# EAGLE design Zeitraffer_V0.2 (EAGLE 8.3.2)
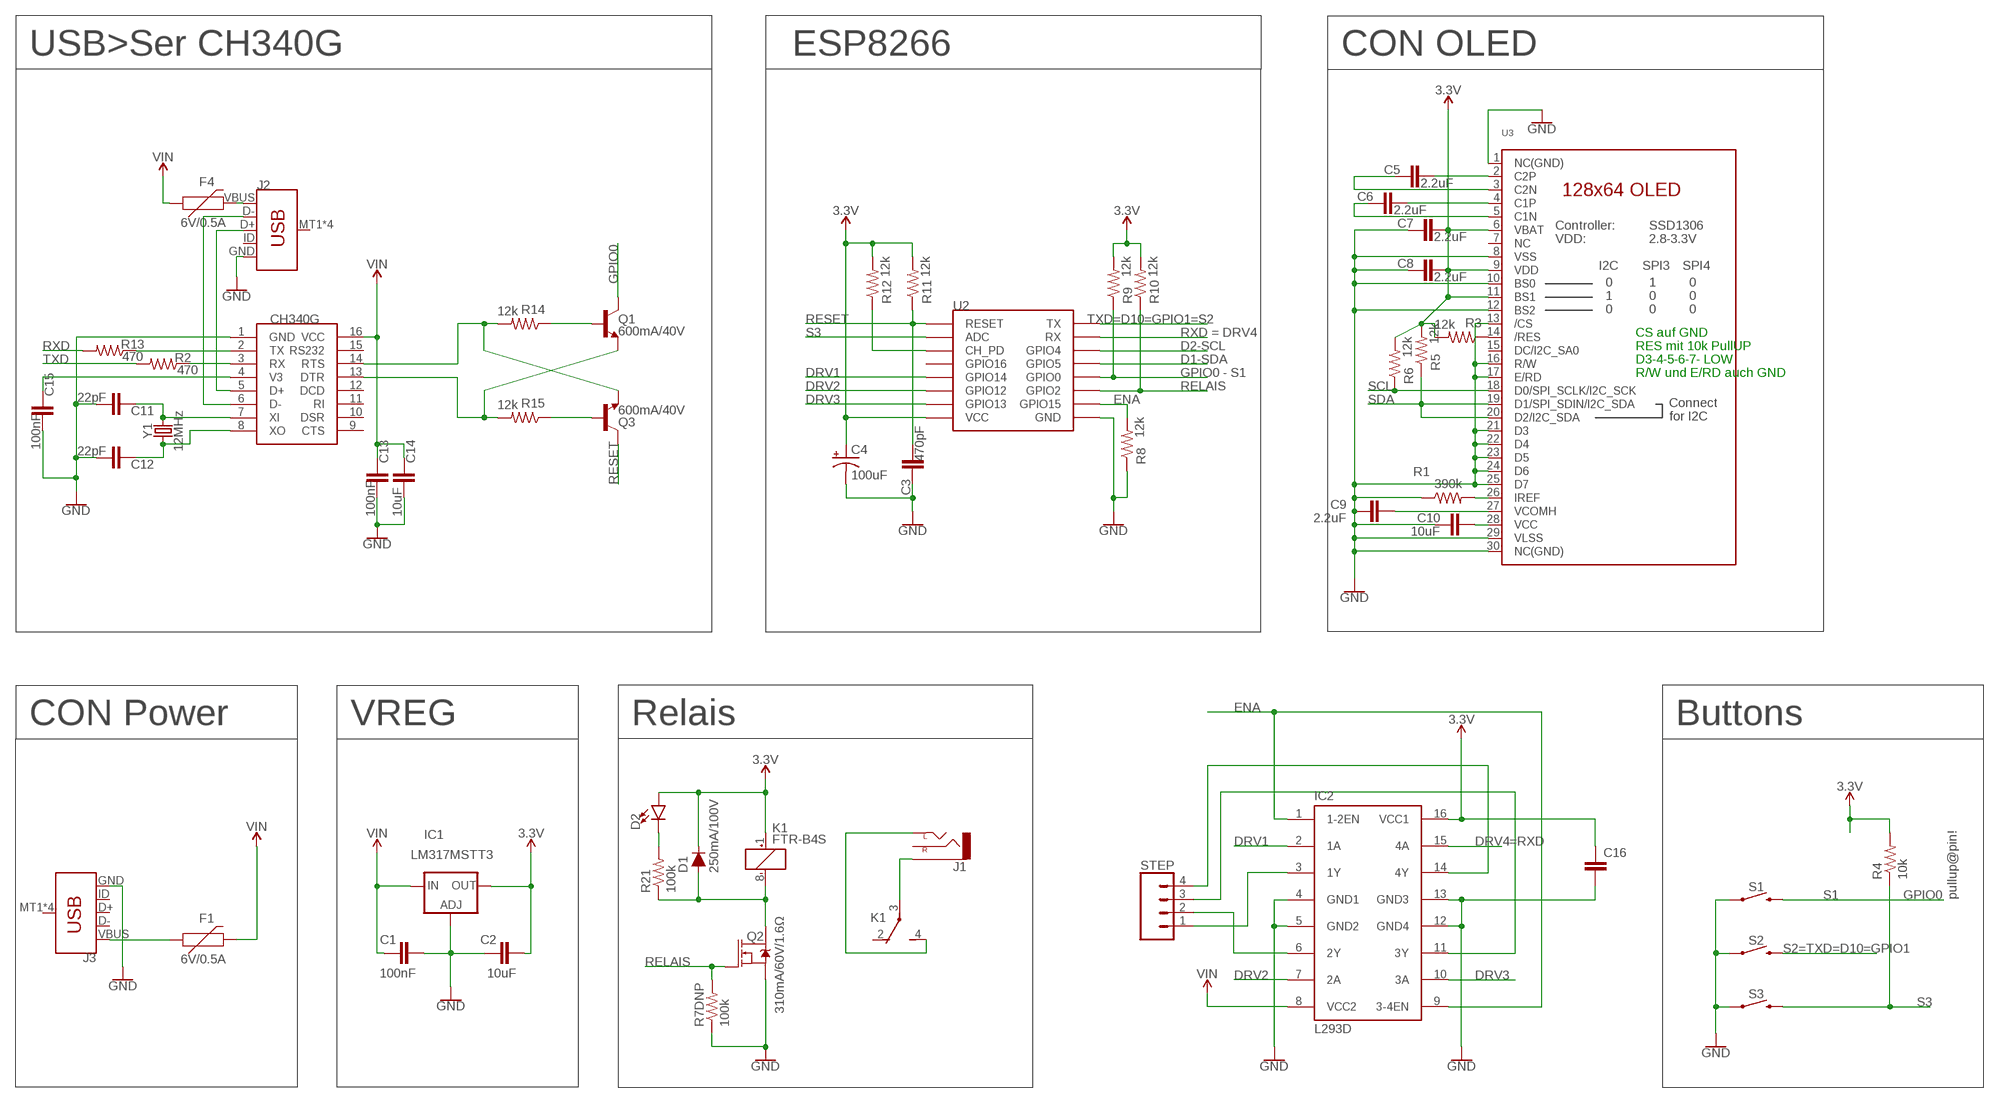
[diagram p0: schematic, sheet 1]

## Parts
C1  100nF  1.0UF-0805-25V-10%  [0805]
C2  10uF  0.33UF/330NF-0805-50V-10%  [0805]
C3  470pF  2.2UF-0805-25V-(+80/-20%)  [0805]
C4  100uF  100UF-POLAR-EIA7343-16V-10%(TANT)  [EIA7343]
C5  2.2uF  2.2UF-0805-25V-(+80/-20%)  [0805]
C6  2.2uF  2.2UF-0805-25V-(+80/-20%)  [0805]
C7  2.2uF  2.2UF-0805-25V-(+80/-20%)  [0805]
C8  2.2uF  2.2UF-0805-25V-(+80/-20%)  [0805]
C9  2.2uF  2.2UF-0805-25V-(+80/-20%)  [0805]
C10  10uF  2.2UF-0805-25V-(+80/-20%)  [0805]
C11  22pF  2.2UF-0805-25V-(+80/-20%)  [0805]
C12  22pF  2.2UF-0805-25V-(+80/-20%)  [0805]
C13  100nF  2.2UF-0805-25V-(+80/-20%)  [0805]
C14  10uF  2.2UF-0805-25V-(+80/-20%)  [0805]
C15  100nF  2.2UF-0805-25V-(+80/-20%)  [0805]
C16  C-EUC0805  [C0805]
D1  250mA/100V  DIODE-BAS16J  [SOD-323]
D2  LED1206-BOTTOM  [LED-1206-BOTTOM]
F1  6V/0.5A  PPTC_HALF-AMP  [1206]
F4  6V/0.5A  PPTC_HALF-AMP  [1206]
IC1  LM317MSTT3  [SOT223]
IC2  L293D  [DIL16]
J1  AUDIO_JACK_2.5MM_2.5MM  [STEREOJACK2.5MM_STEREOJACK2.5MM]
J2  USB_MICRO-B_SMT  [USB-MICROB]
J3  USB_MICRO-B_SMT  [USB-MICROB]
K1  FTR-B4S  [FTR-B4S]
Q1  600mA/40V  TRANS_NPN-MMBT2222AL  [SOT23-3]
Q2  310mA/60V/1.6Ω  MOSFET-NCH-2N7002PW  [SOT323]
Q3  600mA/40V  TRANS_NPN-MMBT2222AL  [SOT23-3]
R1  390k  0.75OHM-0805-1/4W-1%  [0805]
R2  470  470OHM-0603-1/10W-1%  [0603]
R3  12k  R-US_R0805  [R0805]
R4  10k  R-US_R0805  [R0805]
R5  12k  R-US_R0805  [R0805]
R6  12k  R-US_R0805  [R0805]
R7DNP  100k  R-US_R0805  [R0805]
R8  12k  R-US_R0805  [R0805]
R9  12k  R-US_R0805  [R0805]
R10  12k  R-US_R0805  [R0805]
R11  12k  R-US_R0805  [R0805]
R12  12k  R-US_R0805  [R0805]
R13  470  470OHM-0603-1/10W-1%  [0603]
R14  12k  R-US_R0805  [R0805]
R15  12k  R-US_R0805  [R0805]
R21  100k  R-US_R0805  [R0805]
S1  MOMENTARY-SWITCH-SPST-PTH-6.0MM  [TACTILE_SWITCH_PTH_6.0MM]
S2  MOMENTARY-SWITCH-SPST-PTH-6.0MM  [TACTILE_SWITCH_PTH_6.0MM]
S3  MOMENTARY-SWITCH-SPST-PTH-6.0MM  [TACTILE_SWITCH_PTH_6.0MM]
STEP  CONN_04JST-PTH  [JST-4-PTH]
U2  ESP12SMD  [ESP12-SMD]
U3  DISP_OLED_UG-2864HSWEG01  [UG-2864HSWEG01_1.3_WRAPAROUND]
U$2  CH340G  [SOIC16]
Y1  12MHz  CRYSTAL-12MHZ"  [CRYSTAL-SMD-5X3.2-4PAD]

## Nets
3.3V: C2.2 C4.A(+) C7.2 C8.2 C16.1 D1.C D2.A IC1.4(OUT) IC2.16(VCC1) K1.1(K:+) R3.2 R4.2 R5.2 R6.2 R9.2 R10.2 R11.2 R12.2 U2.VCC U3.6(VBAT) U3.9(VDD) U3.11(BS1)
DRV1: IC2.2(1A) U2.GPIO14
DRV2: IC2.7(2A) U2.GPIO12
DRV3: IC2.10(3A) U2.GPIO13
ENA: IC2.1(1-2EN) IC2.9(3-4EN) R8.2 U2.GPIO15
GND: C1.2 C2.1 C3.1 C4.C(-) C7.1 C8.1 C9.1 C10.1 C11.2 C12.2 C13.2 C14.2 C15.2 C16.2 IC1.1(ADJ) IC2.4(GND1) IC2.5(GND2) IC2.12(GND4) IC2.13(GND3) J2.GND J3.GND Q2.2(S) R1.1 R7DNP.1 R8.1 S1.1 S2.1 S3.1 U2.GND U3.1(NC(GND)) U3.8(VSS) U3.10(BS0) U3.12(BS2) U3.13(/CS) U3.16(R/W) U3.17(E/RD) U3.21(D3) U3.22(D4) U3.23(D5) U3.24(D6) U3.25(D7) U3.29(VLSS) U3.30(NC(GND)) U$2.1(GND)
GPIO0: Q1.3(C) R9.1 S1.3 U2.GPIO0
N$1: F1.1 J3.VBUS
N$2: J1.RING1(SLEEVE) K1.3(-1:P)
N$3: D1.A K1.8(K:-) Q2.3(D) R21.1
N$4: J1.SHIELD(LEFT) K1.4(-1:S)
N$5: C5.2 U3.2(C2P)
N$6: C6.2 U3.4(C1P)
N$7: C5.1 U3.3(C2N)
N$8: C6.1 U3.5(C1N)
N$9: R1.2 U3.26(IREF)
N$10: C9.2 U3.27(VCOMH)
N$11: C10.2 U3.28(VCC)
N$12: R3.1 U3.14(/RES)
N$14: C11.1 U$2.7(XI) Y1.3
N$15: R12.1 U2.CH_PD
N$16: C12.1 U$2.8(XO) Y1.1
N$18: J2.D+ U$2.5(D+)
N$20: J2.D- U$2.6(D-)
N$21: Q3.2(E) R14.2 U$2.14(RTS)
N$22: Q1.2(E) R15.2 U$2.13(DTR)
N$23: R13.1 U$2.2(TX)
N$24: R2.1 U$2.3(RX)
N$25: C15.1 U$2.4(V3)
N$26: Q3.1(B) R15.1
N$27: Q1.1(B) R14.1
N$28: IC2.3(1Y) STEP.1
N$29: IC2.6(2Y) STEP.2
N$30: F4.2 J2.VBUS
N$31: D2.C R21.2
N$32: IC2.14(4Y) STEP.4
N$33: IC2.11(3Y) STEP.3
RELAIS: Q2.1(G) R7DNP.2 R10.1 U2.GPIO2
RESET: C3.2 Q3.3(C) R11.1 U2.RESET
RXD: IC2.15(4A) R13.2 U2.RXD0(RX)
S3: R4.1 S3.3 U2.ADC
SCL: R6.1 U2.GPIO4 U3.18(D0/SPI_SCLK/I2C_SCK)
SDA: R5.1 U2.GPIO5 U3.19(D1/SPI_SDIN/I2C_SDA) U3.20(D2/I2C_SDA)
TXD: R2.2 S2.3 U2.TXD0(TX)
VIN: C1.1 C13.1 C14.1 F1.2 F4.1 IC1.3(IN) IC2.8(VCC2) U$2.16(VCC)
Unconnected: J1.TIP(RIGHT) J2.ID J2.MT1(SHIELD) J2.MT2(SHIELD) J2.P$1(SHIELD) J2.P$2(SHIELD) J3.D+ J3.D- J3.ID J3.MT1(SHIELD) J3.MT2(SHIELD) J3.P$1(SHIELD) J3.P$2(SHIELD) K1.2(-1:O) K1.5(-2:S) K1.6(-2:P) K1.7(-2:O) U2.GPIO16 U3.7(NC) U3.15(DC/I2C_SA0) U$2.9(CTS) U$2.10(DSR) U$2.11(RI) U$2.12(DCD) U$2.15(RS232)

## Notes on the sheet
- USB>Ser CH340G | ESP8266 | CON OLED
- GPIO0
- RESET | TXD=D10=GPIO1=S2
- S3 | RXD = DRV4 | CS auf GND
- RXD | D2-SCL | RES mit 10k PullUP
- TXD | D1-SDA | D3-4-5-6-7- LOW
- DRV1 | GPIO0 - S1 | R/W und E/RD auch GND
- DRV2 | RELAIS | SCL
- DRV3 | ENA | SDA
- RESET
- ENA
- CON Power | VREG | Relais | Buttons
- DRV1 | DRV4=RXD
- S1 | GPIO0 | pullup@pin!
- S2=TXD=D10=GPIO1
- RELAIS
- DRV2 | DRV3
- S3

## Library data of the parts
C1 = SparkFun-Capacitors:1.0UF: 1µF ceramic capacitors A capacitor is a passive two-terminal electrical component used to store electrical energy temporarily in an electric field.; PROD_ID: CAP-08064; VALUE: 1.0uF
C2 = SparkFun-Capacitors:0.33UF/330NF: 0.33µF/330nF ceramic capacitors A capacitor is a passive two-terminal electrical component used to store electrical energy temporarily in an electric field.; PROD_ID: CAP-08469; VALUE: 0.33µF
C3 C10-C15 = SparkFun-Capacitors:2.2UF: 2.2µF ceramic capacitors A capacitor is a passive two-terminal electrical component used to store electrical energy temporarily in an electric field.; PROD_ID: CAP-11624; VALUE: 2.2uF
C4 = SparkFun-Capacitors:100UF-POLAR: 100µF polarized capacitors A capacitor is a passive two-terminal electrical component used to store electrical energy temporarily in an electric field.; PROD_ID: CAP-08702
C5-C9 = SparkFun-Capacitors:2.2UF: 2.2µF ceramic capacitors A capacitor is a passive two-terminal electrical component used to store electrical energy temporarily in an electric field.; PROD_ID: CAP-11624
C16 = resistor:C-EU: CAPACITOR, European symbol
D1 = SparkFun-DiscreteSemi:DIODE: Diode These are standard reverse protection diodes and small signal diodes. SparkFun Products: SparkFun SparkPunk Sound Kit <https://www.sparkfun.com/products/11177> SparkFun ESP8266 Thing <https://www.sparkfun.com/products/13231>; PROD_ID: DIO-09646
D2 = SparkFun-LED:LED: LED (Generic) Standard schematic elements and footprints for 5mm, 3mm, 1206, and 0603 sized LEDs. Generic LEDs with no color specified.
F1 F4 = SparkFun-Fuses:PPTC: Resettable Fuse PPTC Resettable Fuse. Really a sort of resistor with a polymeric positive temperature coefficient whose resistance increases dramatically with an increase in temperature. When heated by the power passing through the resistance rises causing the current to be limited, protecting the circuit. This is achieved by the transition of the polymer from a crystalline to an amorphous state where the conductive carbon separates breaking the conductive pathways found in the cool crystalline structure. When a PPTC cools back down it resumes conducting letting the circuit turn back on. SparkFun Products: SparkFun RedBoard - Programmed with Arduino <https://www.sparkfun.com/products/12757> Pro Micro - 5V/16MHz <https://www.sparkfun.com/products/12640> Arduino Pro 328 - 5V/16MHz <https://www.sparkfun.com/products/10915> MP3 Trigger <https://www.sparkfun.com/products/13720>; PROD_ID: RES-08585
IC1 = v-reg:LM317?*: 500 mA Adjustable Output Positive Voltage Regulator Source: http://www.onsemi.co.jp .. LM317M-D.PDF
IC2 = L293D.lbrst-microelectronics:L293D: PUSH-PULL 4 CHANNEL DRIVER
J1 = SparkFun-Connectors:AUDIO_JACK_2.5MM: Audio Jack 2.5mm variants of PTH and SMT audio jacks. SparkFun Products: SparkFun PicoBoard <https://www.sparkfun.com/products/11888>- 2.5mm SMD; PROD_ID: CONN-09878
J2 J3 = SparkFun-Connectors:USB_MICRO-B: USB Type Micro-B Connector Male/female and PTH/SMT variants SparkFun Products: SparkFun microB USB Breakout <https://www.sparkfun.com/products/12035> SparkFun USB microB Plug Breakout <https://www.sparkfun.com/products/10031> SparkFun ESP8266 Thing <https://www.sparkfun.com/products/13231>; PROD_ID: CONN-09505; SF_ID: PRT-08533
K1 = relay:FTR-B4: ULTRA MINIATURE RELAY 2 POLES - 2 A (Slim Profile Signal Relay) FUJITSU FTR-B4 SERIES Source: FTR-B4.pdf
Q1 Q3 = SparkFun-DiscreteSemi:TRANS_NPN: NPN transistor Current controlled devices typically used to amplify current or used as a switch. BC547 - COM-08928 <http://www.sparkfun.com/products/8928> (TO-92 45V 100mA) (1.Collector 2.Base 3.Emitter) 2N3904 - COM-00521 <http://www.sparkfun.com/products/521> (TO-92 40V 200mA) (1.Emitter 2.Base 3.Collector) P2N2222A - COM-12852 <http://www.sparkfun.com/products/12852> (TO-92 40V 600mA) (1.Collector 2.Base 3.Emitter); PROD_ID: TRANS-08049
Q2 = SparkFun-DiscreteSemi:MOSFET-NCH: N-channel MOSFETs Voltage controlled devices that allow control of high current outputs. SparkFun Products: SparkFun OpenScale <https://www.sparkfun.com/products/13261> SparkFun Digital Sandbox <https://www.sparkfun.com/products/12651> SparkFun Monster Moto Shield <https://www.sparkfun.com/products/10182> SparkFun MOSFET Power Controller <https://www.sparkfun.com/products/11214>; PROD_ID: TRANS-11151
R1 = SparkFun-Resistors:0.75OHM: 0.75Ω resistor A resistor is a passive two-terminal electrical component that implements electrical resistance as a circuit element. Resistors act to reduce current flow, and, at the same time, act to lower voltage levels within circuits. - Wikipedia; PROD_ID: RES-08474; VALUE: 0.75
R2 R13 = SparkFun-Resistors:470OHM: 470Ω resistor A resistor is a passive two-terminal electrical component that implements electrical resistance as a circuit element. Resistors act to reduce current flow, and, at the same time, act to lower voltage levels within circuits. - Wikipedia; PROD_ID: RES-07869
R3-R6 R7DNP R8-R12 R14 R15 R21 = adafruit:R-US_: RESISTOR, American symbol
S1-S3 = SparkFun-Switches:MOMENTARY-SWITCH-SPST: Momentary Switch (Pushbutton) - SPST Normally-open (NO) SPST momentary switches (buttons, pushbuttons). Variants PTH-12MM - 12mm square, through-hole Momentary Pushbutton Switch - 12mm Square <https://www.sparkfun.com/products/9190> (COM-09190) PTH-6.0MM, PTH-6.0MM-KIT - 6.0mm square, through-hole Mini Pushbutton Switch <https://www.sparkfun.com/products/97> (COM-00097) KIT package intended for soldering kit's - only one side of pads' copper is exposed. PTH-RIGHT-ANGLE-KIT - Right-angle, through-hole Right Angle Tactile Button <https://www.sparkfun.com/products/10791> - Used on SparkFun BigTime Watch Kit <https://www.sparkfun.com/products/11734> SMD-12MM - 12mm square, surface-mount Tactile Button - SMD (12mm) <https://www.sparkfun.com/products/12993> (COM-12993) Used on SparkFun PicoBoard <https://www.sparkfun.com/products/11888> SMD-4.5MM - 4.5mm Square Trackball Switch Used on SparkFun Blackberry Trackballer Breakout <https://www.sparkfun.com/products/13169> SMD-4.6MMX2.8MM - 4.60mm x 2.80mm, surface mount Used on SparkFun SAMD21 Mini Breakout <https://www.sparkfun.com/products/13664> SMD-5.2MM, SMD-5.2-REDUNDANT - 5.2mm square, surface-mount Mini Pushbutton Switch - SMD <https://www.sparkfun.com/products/8720> (COM-08720) Used on Arduino Pro Mini <https://www.sparkfun.com/products/11114> REDUNDANT package connects both switch circuits together SMD-6.0X3.5MM - 6.0 x 3.5mm, surface mount Momentary Reset Switch SMD <https://www.sparkfun.com/products/8229> (COM-08229) SMD-6.2MM-TALL - 6.2mm square, surface mount Tactile Button - SMD (6mm) <https://www.sparkfun.com/products/12992> Used on SparkFun Digital Sandbox <https://www.sparkfun.com/products/12651> SMD-RIGHT-ANGLE - Right-angle, surface mount Used on SparkFun Block for Intel® Edison - Arduino <https://www.sparkfun.com/products/13036>; PROD_ID: SWCH-08441; SF_SKU: COM-00097
STEP = SparkFun-Connectors:CONN_04: Multi connection point. Often used as Generic Header-pin footprint for 0.1 inch spaced/style header connections On any of the 0.1 inch spaced packages, you can populate with these: Break Away Headers - Straight <https://www.sparkfun.com/products/116> (PRT-00116) Break Away Male Headers - Right Angle <https://www.sparkfun.com/products/553> (PRT-00553) Female Headers <https://www.sparkfun.com/products/115> (PRT-00115) Break Away Headers - Machine Pin <https://www.sparkfun.com/products/117> (PRT-00117) Break Away Female Headers - Swiss Machine Pin <https://www.sparkfun.com/products/743> (PRT-00743) For SCREWTERMINALS and SPRING TERMINALS visit here: Screw Terimnals on SparkFun.com <https://www.sparkfun.com/search/results?term=Screw+Terminals> (5mm/3.5mm/2.54mm spacing) This device is also useful as a general connection point to wire up your design to another part of your project. Our various solder wires solder well into these plated through hole pads. Hook-Up Wire - Assortment (Stranded, 22 AWG) <https://www.sparkfun.com/products/11375> (PRT-11375) Hook-Up Wire - Assortment (Solid Core, 22 AWG) <https://www.sparkfun.com/products/11367> (PRT-11367) View the entire wire category on our website here <https://www.sparkfun.com/categories/141> Special notes: Molex polarized connector foot print use with SKU : PRT-08231 with associated crimp pins and housings. 1MM SMD Version SKU: PRT-10208; PROD_ID: WIRE-13531; SF_ID: PRT-09916
U2 = esp8266modules:ESP12: ESP8266 Wifi module 12
U3 = OLED:DISP_OLED_UG-2864HSWEG01: UG-2864HSWEG01 OLED display Both 1.3" and 0.96" models share the same FPC tab footprint, only the screen dimensions vary.
U$2 = ch340g:CH340G
Y1 = SparkFun-Clocks:CRYSTAL-12MHZ: 12.0MHz Crystal Frequency: 12.0MHz Frequency Tolerance: ±20ppm Load Capacitance: 18pF SparkFun Products: SparkFun Logomatic <https://www.sparkfun.com/products/12772> Pocket AVR Programmer <https://www.sparkfun.com/products/9825>; PROD_ID: XTAL-08297

## Board
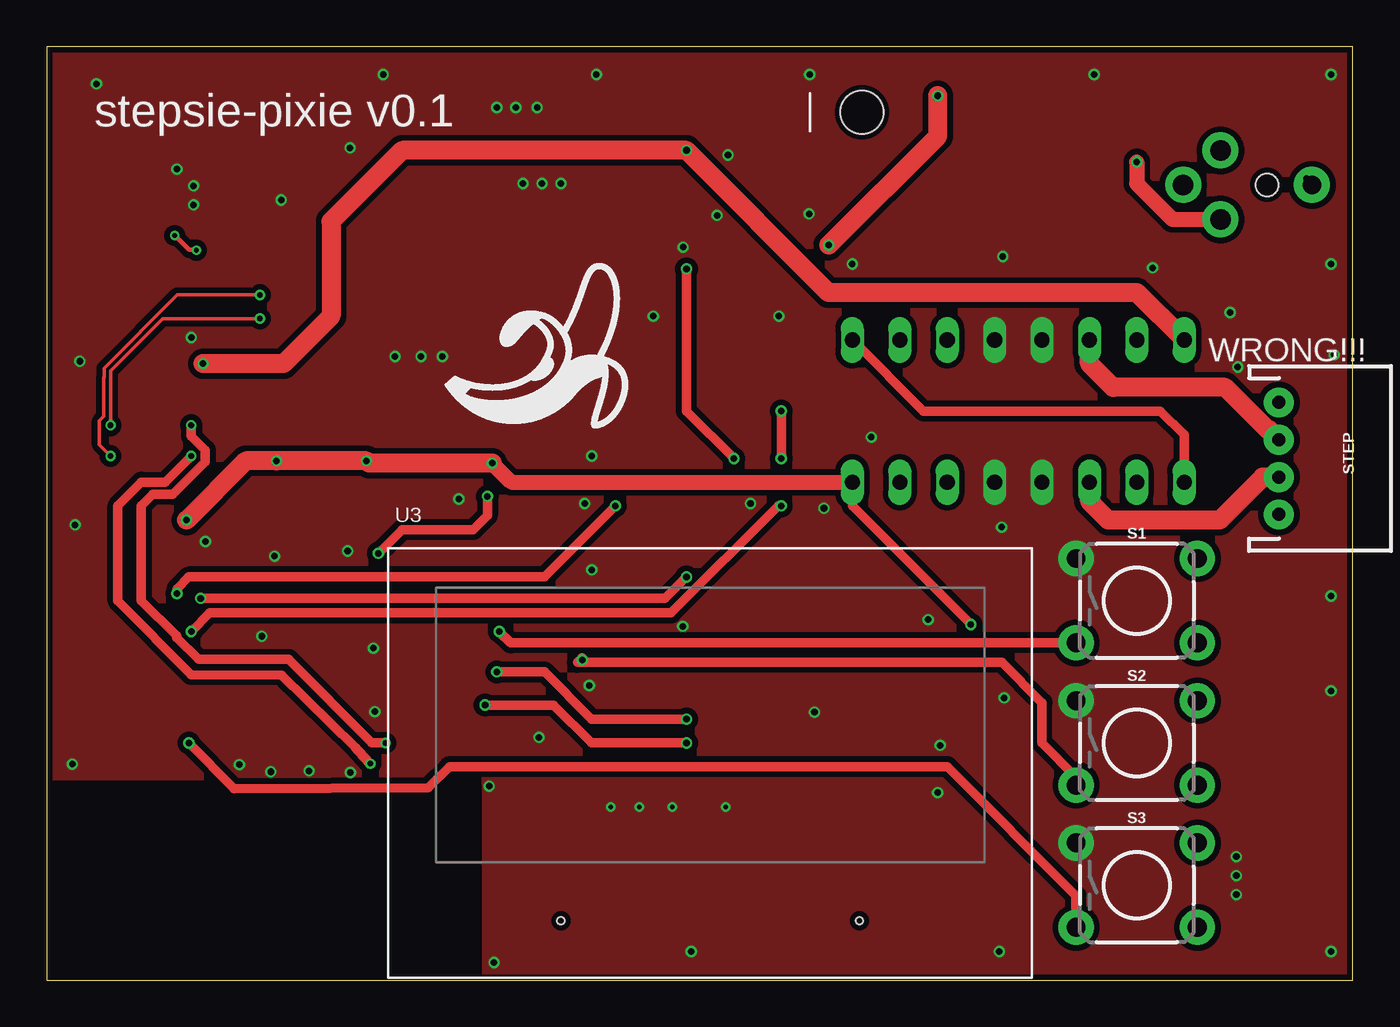
[diagram p1: board, top side]
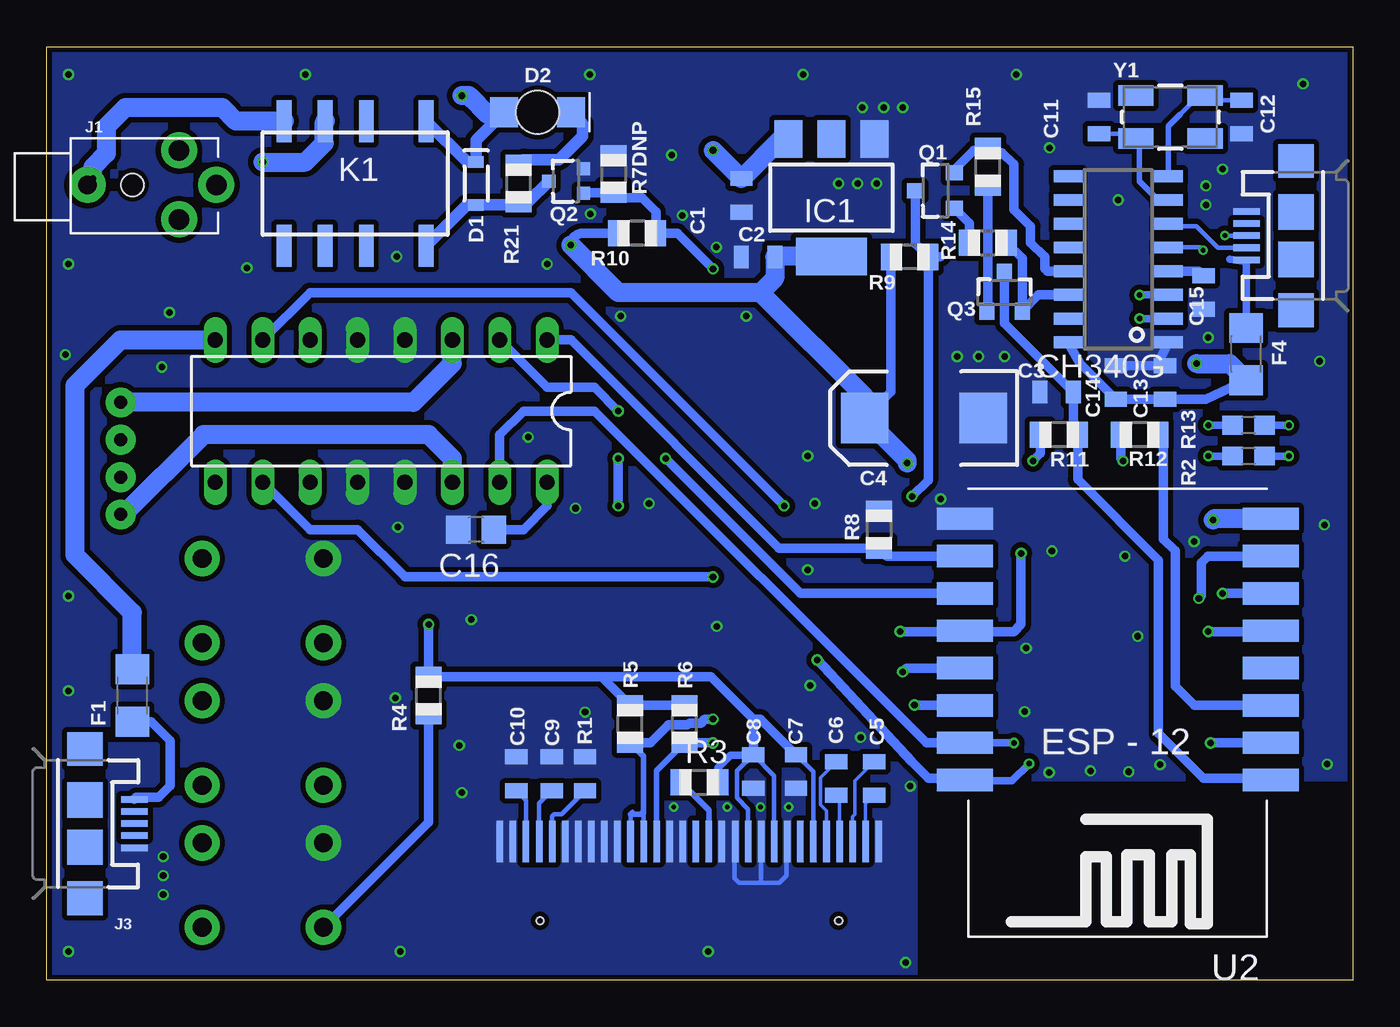
[diagram p2: board, bottom side, seen from below]

Size 70 x 50 mm. Coordinates in mm from the lower left corner, seen from the top.
Outline: 0,0 70,0 70,50 0,50 0,0
Copper layers (1*16): Top 0.018mm / dielectric 1.55mm / Bottom 0.018mm
Design rules "eC_2Layer_PClass6_BaseCopperO18_eCDefault": minimum track width 0.15mm, minimum drill 0.35mm, track to track 0.15mm, track to pad 0.15mm, pad to pad 0.15mm, via to via 0.15mm, smd to smd 0mil, copper to edge 0.25mm, drill to drill 0.35mm, minimum pad ring 0.175mm, minimum via ring 0.125mm, stop-mask expansion 0mil, vias tented up to drill 0.45mm, thermal gap 0.2mm
tRestrict: area -0.6,0.3 to 23,10.4
bRestrict: area -0.6,0 to 23,10.4

### Footprints (pad centres in the part's own frame; a part is rotated, then mirrored left to right if it is on the bottom)
0805 = smd 0.8 x 1.2: 1 -0.9,0; 2 0.9,0
EIA7343 = smd 2.55 x 2.7: A 3.17,0; C -3.17,0
C0805 = smd 1.3 x 1.5: 1 -0.95,0; 2 0.95,0
SOD-323 = smd 0.63 x 0.83: A 1.15,0; C -1.15,0
LED-1206-BOTTOM = smd 1.5 x 1.6: A -1.8,0; C 1.8,0 | hole 2.3: 0,0
1206 = smd 1.6 x 1.8: 1 -1.4,0; 2 1.4,0
SOT223 = smd 1.5 x 2: 1 -2.3,-3.15; 2 0,-3.15; 3 2.3,-3.15 | smd 3.8 x 2: 4 0,3.15
DIL16 = drill 0.813 long: 1 -8.89,-3.81; 2 -6.35,-3.81; 3 -3.81,-3.81; 4 -1.27,-3.81; 5 1.27,-3.81; 6 3.81,-3.81; 7 6.35,-3.81; 8 8.89,-3.81; 9 8.89,3.81; 10 6.35,3.81; 11 3.81,3.81; 12 1.27,3.81; 13 -1.27,3.81; 14 -3.81,3.81; 15 -6.35,3.81; 16 -8.89,3.81
STEREOJACK2.5MM_STEREOJACK2.5MM = drill 1.1 pad 1.93: RING1 2.5,-1.85; RING2 2.5,1.85; TIP 4.5,0 | drill 1 pad 1.93: SHIELD -2.4,0 | hole 1.2: 0,0
USB-MICROB = smd 1.4 x 0.35: D+ -2.65,0; D- -2.65,-0.65; GND -2.65,1.3; ID -2.65,0.65; VBUS -2.65,-1.3 | smd 1.9 x 1.8: MT1 0,-4; MT2 0,4 | smd 1.9 x 1.9: P$1 0,-1.27; P$2 0,1.27
FTR-B4S = smd 0.8 x 2.25: 1 -3.8,-3.345; 2 -0.6,-3.345; 3 1.6,-3.345; 4 3.8,-3.345; 5 3.8,3.345; 6 1.6,3.345; 7 -0.6,3.345; 8 -3.8,3.345
SOT23-3 = smd 0.8 x 0.9: 1 -0.95,-1; 2 0.95,-1; 3 0,1.1
SOT323 = smd 0.7 x 0.7: 1 -0.65,-0.925; 2 0.65,-0.925; 3 0,0.925
0603 = smd 1.1 x 1: 1 -0.85,0; 2 0.85,0
R0805 = smd 1.1 x 1.4: 1 -1,0; 2 1,0
TACTILE_SWITCH_PTH_6.0MM = drill 1.016 pad 1.88: 1 -3.251,2.261; 2 3.251,2.261; 3 -3.251,-2.261; 4 3.251,-2.261
JST-4-PTH = drill 0.7 pad 1.6: 1 -3,0; 2 -1,0; 3 1,0; 4 3,0
ESP12-SMD = smd 3 x 1.2: ADC -8.3,3.8; CH_PD -8.3,1.8; GND 8.1,-8.2; GPIO0 8.1,-2.2; GPIO2 8.1,-4.2; GPIO4 8.1,1.8; GPIO5 8.1,-0.2; GPIO12 -8.3,-4.2; GPIO13 -8.3,-6.2; GPIO14 -8.3,-2.2; GPIO15 8.1,-6.2; GPIO16 -8.3,-0.2; RESET -8.3,5.8; RXD0 8.1,3.8; TXD0 8.1,5.8; VCC -8.3,-8.2
UG-2864HSWEG01_1.3_WRAPAROUND = smd 0.35 x 2.2 bottom: 1 -10.15,-0.2; 2 -9.45,-0.2; 3 -8.75,-0.2; 4 -8.05,-0.2; 5 -7.35,-0.2; 6 -6.65,-0.2; 7 -5.95,-0.2; 8 -5.25,-0.2; 9 -4.55,-0.2; 10 -3.85,-0.2; 11 -3.15,-0.2; 12 -2.45,-0.2; 13 -1.75,-0.2; 14 -1.05,-0.2; 15 -0.35,-0.2; 16 0.35,-0.2; 17 1.05,-0.2; 18 1.75,-0.2; 19 2.45,-0.2; 20 3.15,-0.2; 21 3.85,-0.2; 22 4.55,-0.2; 23 5.25,-0.2; 24 5.95,-0.2; 25 6.65,-0.2; 26 7.35,-0.2; 27 8.05,-0.2; 28 8.75,-0.2; 29 9.45,-0.2; 30 10.15,-0.2 | hole 0.4: -8,-4.45; 8,-4.45
SOIC16 = smd 0.635 x 1.524: 1 -4.445,-2.695; 2 -3.175,-2.695; 3 -1.905,-2.695; 4 -0.635,-2.695; 5 0.635,-2.695; 6 1.905,-2.695; 7 3.175,-2.695; 8 4.445,-2.695; 9 4.445,2.695; 10 3.175,2.695; 11 1.905,2.695; 12 0.635,2.695; 13 -0.635,2.695; 14 -1.905,2.695; 15 -3.175,2.695; 16 -4.445,2.695
CRYSTAL-SMD-5X3.2-4PAD = smd 1.9 x 1.1: 1 -1.85,-1.15; 2 1.85,-1.15; 3 1.85,1.15; 4 -1.85,1.15

### Placement (x,y rotation side)
C1  32.77,42.04 270 bottom
C2  31.88,38.73 0 bottom
C3  15.88,31.5 0 bottom
C4  22.99,30.1 180 bottom
C5  25.65,10.79 270 bottom
C6  27.69,10.79 270 bottom
C7  29.84,11.18 90 bottom
C8  32.13,11.18 90 bottom
C9  42.93,11.05 270 bottom
C10  44.83,11.05 270 bottom
C11  13.59,46.23 90 bottom
C12  5.97,46.23 270 bottom
C13  10.06,32 90 bottom
C14  12.7,32 90 bottom
C15  8,36.83 270 bottom
C16  46.99,24.13 180 bottom
D1  46.99,42.67 270 bottom
D2  43.69,46.48 0 bottom
F1  65.41,15.24 90 bottom
F4  5.71,33.53 90 bottom
IC1  27.94,41.91 180 bottom
IC2  52.07,30.48 180 bottom
J1  65.41,42.6 0 bottom
J2  3.05,39.88 0 bottom
J3  67.94,8.38 180 bottom
K1  53.47,42.67 180 bottom
Q1  22.35,42.29 90 bottom
Q2  42.16,42.8 90 bottom
Q3  18.67,36.83 0 bottom
R1  41.15,11.05 270 bottom
R2  5.59,28.07 180 bottom
R3  35.01,10.59 0 bottom
R4  49.53,15.24 90 bottom
R5  38.73,13.72 90 bottom
R6  35.81,13.72 90 bottom
R7DNP  39.62,43.18 270 bottom
R8  25.4,24.13 270 bottom
R9  23.75,38.73 180 bottom
R10  38.35,40.01 180 bottom
R11  15.75,29.21 180 bottom
R12  11.43,29.21 180 bottom
R13  5.59,29.72 180 bottom
R14  19.56,39.5 0 bottom
R15  19.56,43.56 90 bottom
R21  44.7,42.67 90 bottom
S1  58.42,20.32 0 top
S2  58.42,12.7 0 top
S3  58.42,5.08 0 top
STEP  66.04,27.94 270 top
U2  12.7,16.51 180 bottom
U3  35.56,7.62 0 top
U$2  12.57,38.61 90 bottom
Y1  9.78,46.23 180 bottom

### Tracks (layer width: path | path; a pad name or v marks a point on that pad's centre or on a via)
3.3V  (via drill 0.35)
  Top 0.508: IC2.16 43.18,25.4 v49.53,19.05
  Top 0.813: IC2.16 24.89,26.67 v23.88,27.69
  Top 1.016: v41.91,39.37 47.75,45.21 v47.75,47.37 | v23.88,27.69 17.27,27.69 v17.14,27.81 v12.32,27.81 10.67,27.81 v7.49,24.64
  Bottom 0.254: U3.9 31.01,10.96 C8.2 33.01,11.2 33.01,9.76 32.41,9.16 U3.11 | U3.6 28.91,9.22 28.92,9.23 28.92,11.15 C7.2
  Bottom 0.406: R3.2 34.01,11.38 33.36,12.04 32.17,12.04 C8.2
  Bottom 0.508: v49.53,19.05 R4.2 40.26,16.24 | R9.2 24.75,31.51 C4.A | R6.2 R5.2 40.26,16.24 | R10.2 41.27,40.01 arc-90 v41.91,39.37 | v12.32,27.81 12.43,27.92 R12.2 | v17.14,27.81 16.75,28.21 R11.2 | 32.13,13.97 C8.2 | 32.13,13.97 34.4,16.24 40.26,16.24 | v47.75,47.37 46.86,46.48 D2.A | C7.2 31.74,13.97 32.13,13.97 | C16.1 44.45,24.13 43.18,25.4 IC2.16
  Bottom 0.61: K1.1 47.47,43.82 D1.C 46.99,44.98 D2.A
  Bottom 1.016: IC1.4 30.95,38.76 C2.2 30.98,37.6 31.75,36.83 | v41.91,39.37 39.37,36.83 31.75,36.83 | v47.75,47.37 47.37,47.37 46.36,46.36 | U2.VCC 7.42,24.71 v7.49,24.64 | v23.88,27.69 23.88,27.82 C4.A 26.16,31.24 31.75,36.83
DRV1  (via drill 0.35)
  Top 0.508: v7.75,18.67 8.74,19.66 33.47,19.66 39.21,25.4 v39.37,25.4 | v39.37,30.48 v39.37,27.94
  Bottom 0.508: U2.GPIO14 4.44,18.67 v7.75,18.67 | IC2.2 43.18,31.75 40.64,31.75 v39.37,30.48 | v39.37,27.94 v39.37,25.4
DRV2  (via drill 0.35)
  Top 0.508: v30.48,25.4 26.67,21.59 7.62,21.59 6.99,20.95 v6.99,20.7
  Bottom 0.508: IC2.7 55.88,36.83 41.91,36.83 v30.48,25.4 | v6.99,20.7 6.98,20.71 U2.GPIO12
DRV3  (via drill 0.35)
  Top 0.508: v34.29,21.59 33.15,20.45 v8.26,20.45
  Bottom 0.508: IC2.10 55.88,24.13 53.34,24.13 50.8,21.59 v34.29,21.59 | v8.26,20.45 8.13,20.57 8.13,22.35 7.77,22.71 U2.GPIO13
ENA
  Top 0.508: IC2.9 60.96,29.21 59.69,30.48 46.99,30.48 IC2.1
  Bottom 0.508: U2.GPIO15 24.98,22.71 R8.2 30.75,23.13 41.91,34.29 IC2.1
GND  (via drill 0.25, 0.35)
  Bottom 0.254: U3.8 30.35,7.38 30.35,5.59 30.73,5.21 31.62,5.21 | 31.62,5.21 31.71,5.29 U3.10 | U3.12 33.15,7.38 33.15,5.46 32.89,5.21 31.62,5.21
  Bottom 0.508: U$2.1 10.5,32.9 C13.2 C14.2
  other vias: 31.75,9.27 30.23,9.27 33.53,9.27 34.09,18.95 29.21,21.97 37.72,25.53 28.83,25.53 16.13,22.99 8.51,23.5 41.66,25.27 44.2,29.08 47.24,19.3 51.18,24.26 41.15,14.35 47.88,12.57 51.31,15.11 47.75,10.03 43.18,38.35 2.67,48.01 1.78,33.15 29.21,28.07 32.51,35.56 39.24,35.56 63.75,6.6 68.83,15.49 68.83,20.57 68.83,1.52 51.05,1.52 34.54,1.52 23.97,0.93 1.37,11.56 14.07,11.21 1.52,24.38 18.03,48.51 29.46,48.51 40.89,48.51 18.67,33.4 20.07,33.4 21.21,33.4 25.53,42.67 26.54,42.67 27.56,42.67 26.29,46.74 25.15,46.74 24.13,46.74 7.87,41.53 7.87,42.55 6.99,43.43 63.75,5.59 63.75,4.57 68.83,38.35 68.83,48.51 56.13,48.51 7.75,34.42 16.26,44.58 12.57,41.78 29.08,15.77 40.86,41.05 34.11,39.26 35.93,40.96 36.51,44.2 51.24,38.75 59.27,38.15 63.42,35.76 63.83,32.84 69,33.5 23.72,10.38 26.38,13 12.01,11.16 10.33,11.54 16.28,11.12 17.59,14.38 17.51,17.77 11.53,18.41 12.21,22.71 22.09,25.77 36.39,9.27
  pour Bottom (isolate 0.28, no thermals): -2.54,77.47 106.68,77.47 106.68,-10.16 -2.54,-10.16
  pour Top (isolate 0.305, no thermals): -5.08,52.07 -5.08,-2.54 73.66,-2.54 73.66,52.07
GPIO0  (via drill 0.35)
  Top 0.508: S1.3 24.87,18.06 v24.26,18.67 | v23.62,25.91 23.62,24.89 22.86,24.13 19.05,24.13 v17.78,22.86
  Bottom 0.508: R9.1 23.45,39.44 Q1.3 | R9.1 22.1,38.73 | 20.84,18.67 v24.26,18.67 | 20.84,18.67 U2.GPIO0 | v17.78,22.86 17.78,19.05 18.16,18.67 20.84,18.67 | v23.62,25.91 22.75,26.78 R9.1
N$1
  Bottom 0.508: J3.VBUS 65.2,9.78 64.01,9.78 63.37,10.41 63.37,12.83 64.39,13.84 F1.1
N$2  (via drill 0.35)
  Top 0.813: v58.42,43.82 58.42,42.66 60.33,40.75 J1.RING1
  Bottom 1.016: v58.42,43.82 v58.42,43.81 56.13,43.81 55.12,44.83 55.12,45.97 K1.3
N$3
  Bottom 0.61: Q2.3 44.22,41.67 R21.1 44.85,41.52 D1.A 47.47,41.52 K1.8
N$4  (via drill 0.35)
  Top 0.508: J1.SHIELD v67.53,42.95
  Bottom 1.016: K1.4 59.86,46.02 60.58,46.74 65.79,46.74 66.8,45.72 66.8,44.28 67.53,43.55 v67.53,42.95 67.76,42.72
N$5
  Bottom 0.2: U3.2 26.11,9.44 C5.2
N$6
  Bottom 0.2: U3.4 27.51,9.72 C6.2
N$7
  Bottom 0.2: U3.3 26.81,8.75 26.67,8.89 26.67,10.68 C5.1
N$8
  Bottom 0.2: U3.5 28.21,9.06 28.54,9.39 28.54,10.84 C6.1
N$9
  Bottom 0.254: U3.26 42.91,8.78 42.8,8.89 42.41,8.89 R1.2
N$10
  Bottom 0.254: U3.27 43.61,9.46 C9.2
N$11
  Bottom 0.254: U3.28 44.31,9.63 C10.2
N$12
  Bottom 0.305: U3.14 34.51,9.09 R3.1
N$14
  Bottom 0.254: U$2.7 10.03,41.78 | Y1.3 11.5,45.33 C11.1
  Bottom 0.305: Y1.3 11.43,44.88 11.43,42.8 10.41,41.78 U$2.7
N$15
  Bottom 0.508: U2.CH_PD 8.49,14.71 9.53,15.75 9.53,22.99 10.16,23.62 10.16,28.94 R12.1
N$16
  Bottom 0.254: 9.24,46.38 8.13,47.5 7.67,47.5 Y1.1 7.3,47.13 C12.1
  Bottom 0.305: 9.24,46.38 9.88,45.75 U$2.8
N$18  (via drill 0.25)
  Top 0.254: v6.86,39.89 7.63,39.12 8.13,39.12 8.11,39.1 v8.02,39.1
  Bottom 0.254: J2.D+ 6.99,39.88 6.98,39.89 v6.86,39.89 | v8.02,39.1 8.17,39.24 U$2.5
N$20
  Bottom 0.254: U$2.6 9.12,40.39 8.38,40.39 7.22,39.23 J2.D-
N$21
  Bottom 0.508: R14.2 17.72,38.66 Q3.2 16.85,36.7 U$2.14
N$22
  Bottom 0.508: Q1.2 21.35,43.42 20.32,44.45 19.67,44.45 R15.2 19.32,44.32 18.8,44.32 18.16,43.69 18.16,41.27 17.27,40.39 17.27,39.5 16.51,38.73 16.51,38.1 16.38,37.97 U$2.13
N$23  (via drill 0.3)
  Top 0.2: v3.43,29.72 3.43,32.64 6.22,35.43 v11.43,35.43
  Bottom 0.406: U$2.2 v11.43,35.43 | R13.1 v3.43,29.72
N$24  (via drill 0.3)
  Top 0.2: v3.43,28.07 2.82,28.67 2.82,29.97 3.05,30.19 3.05,32.26 3.08,32.29 3.08,32.78 7,36.7 v11.43,36.7
  Bottom 0.406: U$2.3 v11.43,36.7 | R2.1 v3.43,28.07
N$25
  Bottom 0.508: U$2.4 8.24,37.97 C15.1
N$26
  Bottom 0.508: R15.1 19.56,35.89 Q3.1
N$27
  Bottom 0.508: R14.1 20.56,40.55 Q1.1
N$28
  Bottom 1.016: IC2.3 48.26,33.02 50.34,30.94 STEP.1
N$29
  Top 1.016: STEP.2 65.5,29.48 65.44,29.48 63.16,31.75 57.15,31.75 55.88,33.02 IC2.6
N$30
  Bottom 0.305: J2.VBUS 5.73,38.61 6.6,38.61
  Bottom 0.406: 6.6,38.61 5.71,38.48 F4.2
N$31
  Bottom 0.61: R21.2 44.43,43.94 42.55,43.94 41.27,45.21 41.27,45.87 D2.C
N$32
  Bottom 1.016: IC2.14 48.26,27.94 49.53,29.21 61.59,29.21 65.86,24.94 STEP.4
N$33
  Top 1.016: STEP.3 65.17,26.94 62.87,24.64 56.9,24.64 55.88,25.65 IC2.11
RELAIS  (via drill 0.35)
  Top 0.508: v36.83,27.94 34.29,30.48 v34.29,38.1
  Bottom 0.508: U2.GPIO2 29.6,20.71 v36.83,27.94 | v34.29,38.1 36.2,40.01 R10.1 37.35,41.16 38.1,41.91 39.35,41.91 R7DNP.2 41.21,42.18 Q2.1
RESET
  Bottom 0.508: 18.67,35.18 18.67,35.56 | 18.67,35.56 Q3.3 | U2.RESET 4.49,10.79 8,10.79 10.41,13.21 10.41,22.48 14.75,26.81 R11.1 14.97,29.44 C3.2 18.67,35.19 18.67,35.56
RXD  (via drill 0.3)
  Top 0.508: v7.75,29.72 7.75,29.14 8.51,28.38 8.51,27.75 6.76,26.01 5.69,26.01 5.08,25.4 5.08,20.32 6.96,18.44 6.96,18.34 8.14,17.17 12.98,17.17 17.42,12.7 v18.16,12.7
  Bottom 0.406: R13.2 v7.75,29.72 | U2.RXD0 v18.16,12.7
  Bottom 0.508: IC2.15 45.72,29.21 44.45,30.48 40.64,30.48 22.86,12.7 U2.RXD0
S3  (via drill 0.35)
  Top 0.508: S3.3 55.17,4.52 48.26,11.43 21.59,11.43 20.44,10.31 10.05,10.26 v7.62,12.7
  Bottom 0.508: R4.1 49.53,8.46 S3.3 | v7.62,12.7 U2.ADC
SCL  (via drill 0.35)
  Top 0.508: v23.5,14.73 27.18,14.73 29.21,12.7 v34.29,12.7
  Bottom 0.305: U3.18 37.31,11.22 R6.1
  Bottom 0.508: U2.GPIO4 23.47,14.71 v23.5,14.73 | v34.29,12.7 34.31,12.72 R6.1
SDA  (via drill 0.35)
  Top 0.508: v24.13,16.51 26.67,16.51 29.21,13.97 v34.29,13.97
  Bottom 0.254: U3.20 38.71,8.89 38.71,8.91 38.61,9.02 | U3.19 38.01,8.93 38.1,9.02
  Bottom 0.305: R5.1 38.01,11.99 38.01,8.93 38.05,8.89 38.71,8.89
  Bottom 0.508: U2.GPIO5 23.93,16.71 v24.13,16.51 | v34.29,13.97 34.73,13.97 34.95,13.76 35.56,13.76 35.65,13.67 36.68,13.67 37.64,12.72 R5.1
TXD  (via drill 0.3, 0.35)
  Top 0.508: S2.3 55.17,10.87 53.34,12.7 53.34,14.86 51.18,17.02 28.45,17.02 28.7,17.27 v28.7,17.14 | v17.35,11.59 16.72,12.26 16.54,12.46 12.61,16.33 7.74,16.36 3.81,20.32 3.81,25.4 5.08,26.67 6.35,26.67 v7.75,28.07
  Bottom 0.406: R2.2 v7.75,28.07 | U2.TXD0 20.76,10.67 18.27,10.67 v17.35,11.59
  Bottom 0.508: v28.7,17.14 23.62,11.68 22.73,10.79 20.89,10.79 20.76,10.67
VIN  (via drill 0.35)
  Top 1.016: IC2.8 58.42,36.83 41.91,36.83 v34.29,44.45 19.05,44.45 15.24,40.64 15.24,35.56 12.7,33.02 v8.38,33.02
  Bottom 0.508: F4.1 7.88,31.1 C13.1 C14.1 14.63,33.04 U$2.16
  Bottom 1.016: F1.2 65.41,19.68 68.48,22.76 68.48,31.85 66.04,34.29 IC2.8 | v34.29,44.45 v34.28,44.45 C1.1 30.64,45.06 IC1.3 | v8.38,33.02 6.61,33.02 F4.1

### Text on the board
tPlace: WRONG!!! | C:/Users/Fry/Desktop/BANANA.bmp
tNames: stepsie-pixie v0.1